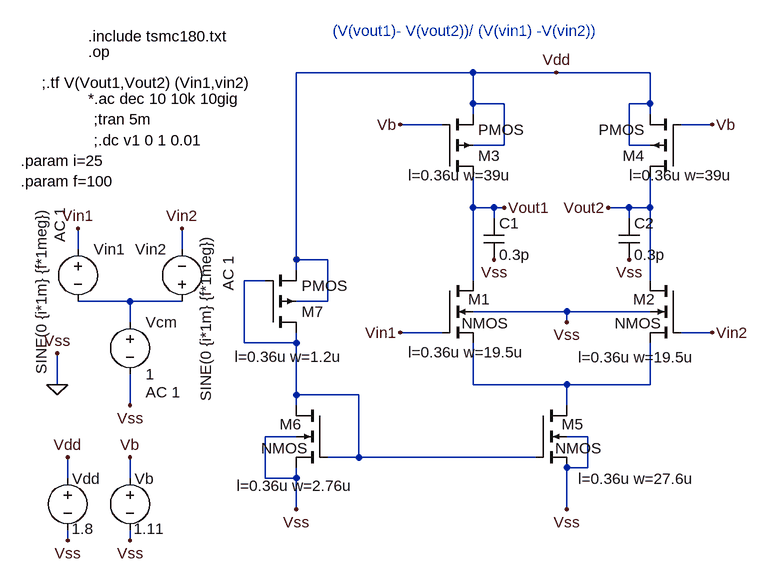
[diagram p0: schematic Differential pair with currrent mirror_3.asc]
Differential pair with currrent mirror_3.asc, the LTspice schematic file:
Version 4
SHEET 1 1248 740
WIRE 624 -64 352 -64
WIRE 752 -64 624 -64
WIRE 896 -64 752 -64
WIRE 624 -16 624 -64
WIRE 672 -16 624 -16
WIRE 896 -16 896 -64
WIRE 896 -16 864 -16
WIRE 624 0 624 -16
WIRE 896 0 896 -16
WIRE 576 16 512 16
WIRE 992 16 944 16
WIRE 672 48 672 -16
WIRE 672 48 624 48
WIRE 864 48 864 -16
WIRE 896 48 864 48
WIRE 624 144 624 96
WIRE 656 144 624 144
WIRE 672 144 656 144
WIRE 864 144 832 144
WIRE 896 144 896 96
WIRE 896 144 864 144
WIRE 656 160 656 144
WIRE 864 160 864 144
WIRE 16 208 16 176
WIRE 176 208 176 176
WIRE 352 224 352 -64
WIRE 400 224 352 224
WIRE 352 240 352 224
WIRE 304 256 272 256
WIRE 624 256 624 144
WIRE 896 256 896 144
WIRE 96 288 16 288
WIRE 176 288 96 288
WIRE 400 288 400 224
WIRE 400 288 352 288
WIRE 768 304 624 304
WIRE 896 304 768 304
WIRE 96 320 96 288
WIRE 768 320 768 304
WIRE 576 336 512 336
WIRE 992 336 944 336
WIRE 272 352 272 256
WIRE 352 352 352 336
WIRE 352 352 272 352
WIRE -16 416 -16 368
WIRE 624 416 624 352
WIRE 768 416 624 416
WIRE 896 416 896 352
WIRE 896 416 768 416
WIRE 352 432 352 352
WIRE 448 432 352 432
WIRE 96 448 96 400
WIRE 352 448 352 432
WIRE 768 448 768 416
WIRE 352 496 304 496
WIRE 800 496 768 496
WIRE 448 528 448 432
WIRE 448 528 400 528
WIRE 720 528 448 528
WIRE 800 544 800 496
WIRE 800 544 768 544
WIRE 0 560 0 528
WIRE 96 560 96 528
WIRE 304 560 304 496
WIRE 352 560 352 544
WIRE 352 560 304 560
WIRE 352 608 352 560
WIRE 768 608 768 544
WIRE 0 656 0 640
WIRE 96 656 96 640
FLAG -16 416 0
FLAG -16 368 Vss
FLAG 0 656 Vss
FLAG 96 448 Vss
FLAG 0 528 Vdd
FLAG 512 336 Vin1
FLAG 752 -64 Vdd
FLAG 992 336 Vin2
FLAG 768 608 Vss
FLAG 768 320 Vss
FLAG 16 176 Vin1
FLAG 176 176 Vin2
FLAG 512 16 Vb
FLAG 992 16 Vb
FLAG 96 656 Vss
FLAG 96 528 Vb
FLAG 672 144 Vout1
FLAG 832 144 Vout2
FLAG 656 224 Vss
FLAG 864 224 Vss
FLAG 352 608 Vss
SYMBOL nmos4 576 256 R0
WINDOW 0 40 29 Left 2
WINDOW 3 30 66 Left 2
WINDOW 123 127 110 Right 2
SYMATTR InstName M1
SYMATTR Value2 l=0.36u w=19.5u
SYMBOL voltage 0 544 R0
WINDOW 123 0 0 Left 0
WINDOW 39 0 0 Left 0
WINDOW 0 7 17 Left 2
WINDOW 3 6 94 Left 2
SYMATTR InstName Vdd
SYMATTR Value 1.8
SYMBOL nmos4 944 256 M0
WINDOW 0 40 29 Left 2
WINDOW 3 30 66 Left 2
WINDOW 123 -21 118 Left 2
SYMATTR InstName M2
SYMATTR Value2 l=0.36u w=19.5u
SYMBOL voltage 96 304 R0
WINDOW 123 24 124 Left 2
WINDOW 39 0 0 Left 0
SYMATTR Value2 AC 1
SYMATTR InstName Vcm
SYMATTR Value 1
SYMBOL voltage 16 192 R0
WINDOW 3 -56 -48 VRight 2
WINDOW 123 -28 -48 VRight 2
WINDOW 39 0 0 Left 0
SYMATTR Value SINE(0 {i*1m} {f*1meg})
SYMATTR Value2 AC 1
SYMATTR InstName Vin1
SYMBOL voltage 176 304 R180
WINDOW 0 24 96 Left 2
WINDOW 3 -37 -138 VRight 2
WINDOW 123 -71 32 VRight 2
WINDOW 39 0 0 Left 0
SYMATTR InstName Vin2
SYMATTR Value SINE(0 {i*1m} {f*1meg})
SYMATTR Value2 AC 1
SYMBOL pmos4 576 96 M180
WINDOW 123 -52 2 Left 2
SYMATTR Value2 l=0.36u w=39u
SYMATTR InstName M3
SYMBOL pmos4 944 96 R180
WINDOW 123 -79 2 Left 2
SYMATTR Value2 l=0.36u w=39u
SYMATTR InstName M4
SYMBOL voltage 96 544 R0
WINDOW 123 0 0 Left 0
WINDOW 39 0 0 Left 0
WINDOW 0 7 17 Left 2
WINDOW 3 6 94 Left 2
SYMATTR InstName Vb
SYMATTR Value 1.11
SYMBOL cap 640 160 R0
SYMATTR InstName C1
SYMATTR Value 0.3p
SYMBOL cap 848 160 R0
SYMATTR InstName C2
SYMATTR Value 0.3p
SYMBOL nmos4 720 448 R0
WINDOW 0 40 29 Left 2
WINDOW 3 30 66 Left 2
WINDOW 123 245 113 Right 2
SYMATTR InstName M5
SYMATTR Value2 l=0.36u w=27.6u
SYMBOL nmos4 400 448 M0
WINDOW 0 40 29 Left 2
WINDOW 3 30 66 Left 2
WINDOW 123 140 124 Right 2
SYMATTR InstName M6
SYMATTR Value2 l=0.36u w=2.76u
SYMBOL pmos4 304 336 M180
WINDOW 123 -47 -37 Left 2
SYMATTR Value2 l=0.36u w=1.2u
SYMATTR InstName M7
TEXT 32 -120 Left 2 !.include tsmc180.txt
TEXT 32 -96 Left 2 !.op
TEXT -40 -48 Left 2 !;.tf V(Vout1,Vout2) (Vin1,vin2)
TEXT 32 -24 Left 2 !*.ac dec 10 10k 10gig
TEXT 40 8 Left 2 !;tran 5m
TEXT 408 -128 Left 2 ;(V(vout1)- V(vout2))/ (V(vin1) -V(vin2))
TEXT 40 40 Left 2 !;.dc v1 0 1 0.01
TEXT -72 72 Left 2 !.param i=25\n.param f=100

The netlist it stands for:
* Differential pair with currrent mirror_3.asc
M1 Vout1 Vin1 N003 0 NMOS l=0.36u w=19.5u
Vdd Vdd 0 1.8
M2 Vout2 Vin2 N003 0 NMOS l=0.36u w=19.5u
Vcm N002 0 1 AC 1
Vin1 Vin1 N002 SINE(0 {i*1m} {f*1meg}) AC 1
Vin2 N002 Vin2 SINE(0 {i*1m} {f*1meg}) AC 1
M3 Vout1 Vb Vdd Vdd PMOS l=0.36u w=39u
M4 Vout2 Vb Vdd Vdd PMOS l=0.36u w=39u
Vb Vb 0 1.11
C1 Vout1 0 0.3p
C2 Vout2 0 0.3p
M5 N003 N001 0 0 NMOS l=0.36u w=27.6u
M6 N001 N001 0 0 NMOS l=0.36u w=2.76u
M7 N001 N001 Vdd Vdd PMOS l=0.36u w=1.2u
.model NMOS NMOS
.model PMOS PMOS
.lib standard.mos
.include tsmc180.txt
.op
;.tf V(Vout1,Vout2) (Vin1,vin2)
*.ac dec 10 10k 10gig
;tran 5m
* (V(vout1)- V(vout2))/ (V(vin1) -V(vin2))
;.dc v1 0 1 0.01
.param i=25
.param f=100
.backanno
.end